# Altium schematic sheet FULL_CB_tp_REV_D.SchDoc
size A4; DrawnBy: Philip Rowse
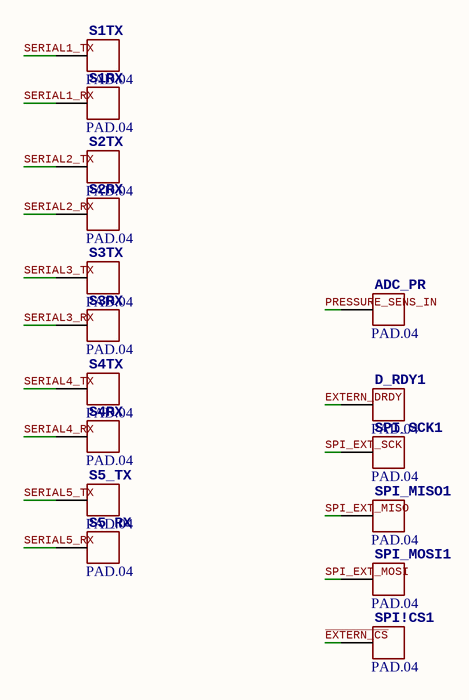
[diagram p0: FULL_CB_tp_REV_D.SchDoc]

## Parts
ADC_PR  PAD.04  [PAD.04X.04]
D_RDY1  PAD.04  [PAD.04X.04]
S1RX  PAD.04  [PAD.04X.04]
S1TX  PAD.04  [PAD.04X.04]
S2RX  PAD.04  [PAD.04X.04]
S2TX  PAD.04  [PAD.04X.04]
S3RX  PAD.04  [PAD.04X.04]
S3TX  PAD.04  [PAD.04X.04]
S4RX  PAD.04  [PAD.04X.04]
S4TX  PAD.04  [PAD.04X.04]
S5_RX  PAD.04  [PAD.04X.04]
S5_TX  PAD.04  [PAD.04X.04]
SPI!CS1  PAD.04  [PAD.04X.04]
SPI_MISO1  PAD.04  [PAD.04X.04]
SPI_MOSI1  PAD.04  [PAD.04X.04]
SPI_SCK1  PAD.04  [PAD.04X.04]

## Nets
~{EXTERN_CS}: SPI!CS1.P$1
EXTERN_DRDY: D_RDY1.P$1
PRESSURE_SENS_IN: ADC_PR.P$1
SERIAL1_RX: S1RX.P$1
SERIAL1_TX: S1TX.P$1
SERIAL2_RX: S2RX.P$1
SERIAL2_TX: S2TX.P$1
SERIAL3_RX: S3RX.P$1
SERIAL3_TX: S3TX.P$1
SERIAL4_RX: S4RX.P$1
SERIAL4_TX: S4TX.P$1
SERIAL5_RX: S5_RX.P$1
SERIAL5_TX: S5_TX.P$1
SPI_EXT_MISO: SPI_MISO1.P$1
SPI_EXT_MOSI: SPI_MOSI1.P$1
SPI_EXT_SCK: SPI_SCK1.P$1

## Notes on the sheet
- Title:
- Date:
- Time:
- https://creativecommons.org/publicdomain/zero/1.0/
- Sheet:
- Approved:
- of:
- Drawn By:
- Checked By:
- ProfiCNC